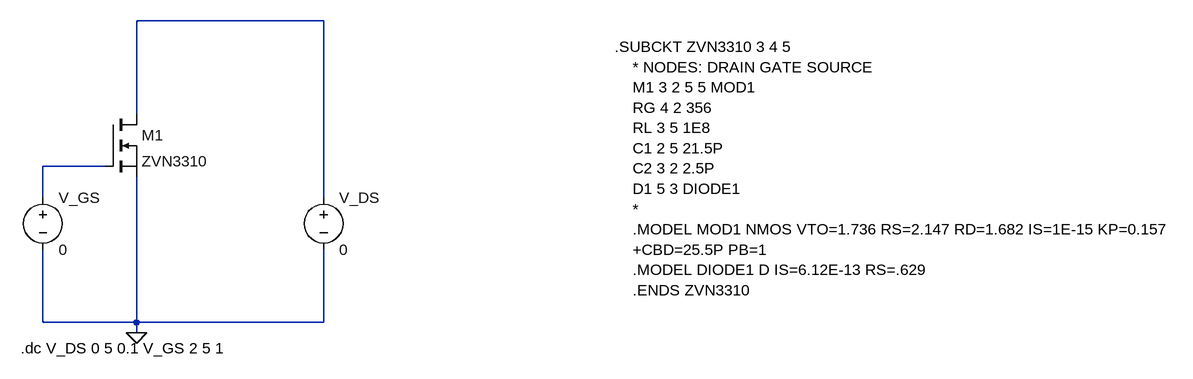
[diagram p0: schematic 10.asc]
10.asc, the LTspice schematic file:
Version 4
SHEET 1 1848 680
WIRE 496 -32 208 -32
WIRE 208 112 208 -32
WIRE 160 192 64 192
WIRE 64 240 64 192
WIRE 496 240 496 -32
WIRE 64 432 64 320
WIRE 208 432 208 208
WIRE 208 432 64 432
WIRE 496 432 496 320
WIRE 496 432 208 432
WIRE 208 448 208 432
FLAG 208 448 0
SYMBOL nmos 160 112 R0
SYMATTR InstName M1
SYMATTR Value ZVN3310
SYMATTR Prefix X
SYMBOL voltage 64 224 R0
WINDOW 123 0 0 Left 0
WINDOW 39 0 0 Left 0
SYMATTR InstName V_GS
SYMATTR Value 0
SYMBOL voltage 496 224 R0
SYMATTR InstName V_DS
SYMATTR Value 0
TEXT 944 8 Left 2 !.SUBCKT ZVN3310 3 4 5\n    * NODES: DRAIN GATE SOURCE\n    M1 3 2 5 5 MOD1   \n    RG 4 2 356\n    RL 3 5 1E8\n    C1 2 5 21.5P\n    C2 3 2 2.5P \n    D1 5 3 DIODE1\n    *\n    .MODEL MOD1 NMOS VTO=1.736 RS=2.147 RD=1.682 IS=1E-15 KP=0.157\n    +CBD=25.5P PB=1\n    .MODEL DIODE1 D IS=6.12E-13 RS=.629\n    .ENDS ZVN3310
TEXT 30 472 Left 2 !.dc V_DS 0 5 0.1 V_GS 2 5 1

The netlist it stands for:
* 10.asc
XM1 N001 N002 0 ZVN3310  ; pins D G S
V_GS N002 0 0
V_DS N001 0 0
.SUBCKT ZVN3310 3 4 5
    * NODES: DRAIN GATE SOURCE
    M1 3 2 5 5 MOD1
    RG 4 2 356
    RL 3 5 1E8
    C1 2 5 21.5P
    C2 3 2 2.5P
    D1 5 3 DIODE1
    *
    .MODEL MOD1 NMOS VTO=1.736 RS=2.147 RD=1.682 IS=1E-15 KP=0.157
    +CBD=25.5P PB=1
    .MODEL DIODE1 D IS=6.12E-13 RS=.629
    .ENDS ZVN3310
.dc V_DS 0 5 0.1 V_GS 2 5 1
.backanno
.end